# Altium project Bluetooth_tag_station_hv2.PrjPcb
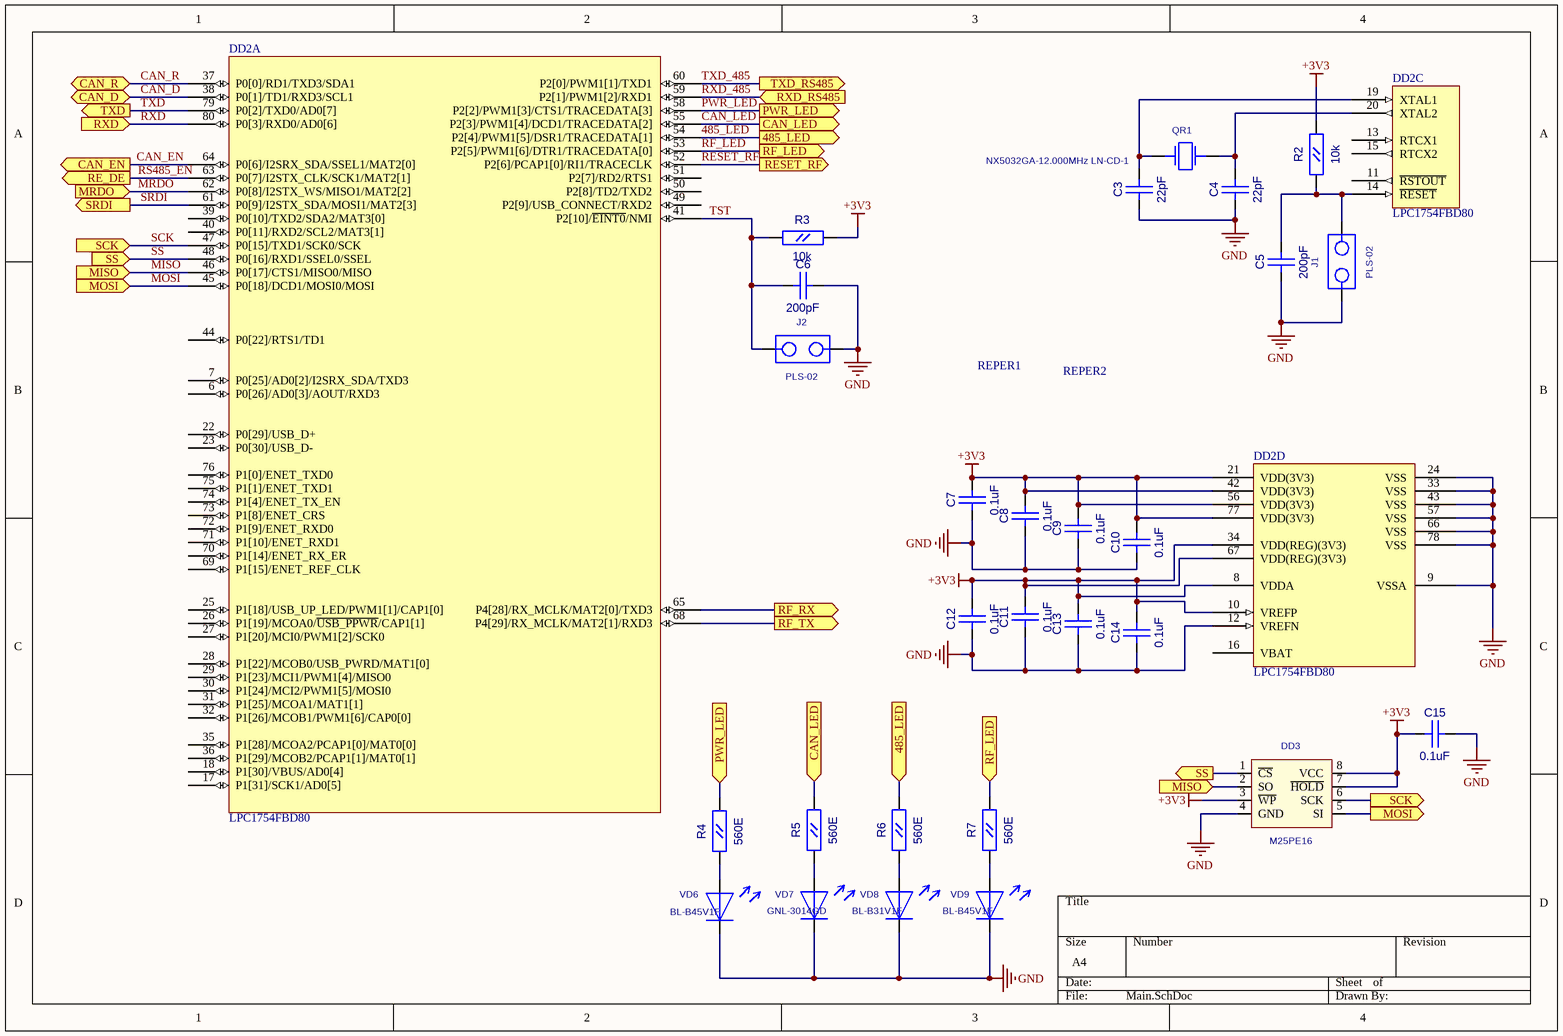
[diagram p0: Main.SchDoc]
3 sheets, 77 parts. Net scope: flat (ports and power ports of the same name join across sheets).
Board file: Bluetooth_tag_station_hv2.PcbDoc
Sheets:
  Main.SchDoc
  Interface.SchDoc
  Power.SchDoc

## Sheet Main.SchDoc
size A4

### Parts
(Parts that share a designator on the sheet are numbered #1, #2 ... from top to bottom, then left to right.)
C3  22pF  [CC0603]
C4  22pF  [CC0603]
C5  200pF  [CC0603]
C6  200pF  [CC0603]
C7  0.1uF  [CC0603]
C8  0.1uF  [CC0603]
C9  0.1uF  [CC0603]
C10  0.1uF  [CC0603]
C11  0.1uF  [CC0603]
C12  0.1uF  [CC0603]
C13  0.1uF  [CC0603]
C14  0.1uF  [CC0603]
C15  0.1uF  [CC0603]
DD2  LPC1754FBD80  [TQFP-80_0.5]  (parts A,C,D of 4)
DD3  M25PE16  [EIAJ_SO8]
J1  PLS-02  [PLS-02]
J2#1  PLS-02  [PLS-02]
QR1  NX5032GA-12.000MHz LN-CD-1  [AC5032_2]
R2  10k  [RC0603]
R3  10k  [RC0603]
R4  560E  [RC0603]
R5  560E  [RC0603]
R6  560E  [RC0603]
R7  560E  [RC0603]
REPER1  REPER1.2  [REPER1.2]  (value not drawn)
REPER2  REPER1.2  [REPER1.2]  (value not drawn)
VD6  BL-B45V1F  [LED3]
VD7  GNL-3014GD  [LED3]
VD8  BL-B31V1F  [LED3]
VD9  BL-B45V1F  [LED3]

### Ports
485_LED (in), 485_LED (out), CAN_D, CAN_EN (out), CAN_LED (in), CAN_LED (out), CAN_R, MISO (in), MOSI (in), MOSI (out), MRDO (in), PWR_LED (in), PWR_LED (out), RE_DE (out), RESET_RF (out), RF_LED (in), RF_LED (out), RF_RX (out), RF_TX (out), RXD (in), RXD_RS485 (in), SCK (in), SCK (out), SRDI (out), SS (in), SS (out), TXD (out), TXD_RS485 (out)

### Nets
+3V3: C7.2(B) C8.2(B) C9.2(B) C10.2(B) C11.2(B) C12.2(B) C13.2(B) C14.2(B) C15.1(A) DD2.8(VDDA) DD2.10(VREFP) DD2.21(VDD(3V3)) DD2.34(VDD(REG)(3V3)) DD2.42(VDD(3V3)) DD2.56(VDD(3V3)) DD2.67(VDD(REG)(3V3)) DD2.77(VDD(3V3)) DD3.3(~{WP}) DD3.7(~{HOLD}) DD3.8(VCC) R2.2(B) R3.2(B)
GND: C3.1(A) C4.1(A) C5.1(A) C6.2(B) C7.1(A) C8.1(A) C9.1(A) C10.1(A) C11.1(A) C12.1(A) C13.1(A) C14.1(A) C15.2(B) DD2.9(VSSA) DD2.12(VREFN) DD2.24(VSS) DD2.33(VSS) DD2.43(VSS) DD2.57(VSS) DD2.66(VSS) DD2.78(VSS) DD3.4(GND) J1.1 J2#1.2 VD6.1 VD7.1 VD8.1 VD9.1
485_LED: DD2.54(P2[4]/PWM1[5]/DSR1/TRACEDATA[1]) R6.2(B) ; port 485_LED
CAN_D: DD2.38(P0[1]/TD1/RXD3/SCL1) ; port CAN_D
CAN_EN: DD2.64(P0[6]/I2SRX_SDA/SSEL1/MAT2[0]) ; port CAN_EN
CAN_LED: DD2.55(P2[3]/PWM1[4]/DCD1/TRACEDATA[2]) R5.2(B) ; port CAN_LED
CAN_R: DD2.37(P0[0]/RD1/TXD3/SDA1) ; port CAN_R
MISO: DD2.46(P0[17]/CTS1/MISO0/MISO) DD3.2(SO) ; port MISO
MOSI: DD2.45(P0[18]/DCD1/MOSI0/MOSI) DD3.5(SI) ; port MOSI
MRDO: DD2.62(P0[8]/I2STX_WS/MISO1/MAT2[2]) ; port MRDO
PWR_LED: DD2.58(P2[2]/PWM1[3]/CTS1/TRACEDATA[3]) R4.2(B) ; port PWR_LED
RESET_RF: DD2.52(P2[6]/PCAP1[0]/RI1/TRACECLK) ; port RESET_RF
RF_LED: DD2.53(P2[5]/PWM1[6]/DTR1/TRACEDATA[0]) R7.2(B) ; port RF_LED
RF_RX: DD2.65(P4[28]/RX_MCLK/MAT2[0]/TXD3) ; port RF_RX
RF_TX: DD2.68(P4[29]/RX_MCLK/MAT2[1]/RXD3) ; port RF_TX
RS485_EN: DD2.63(P0[7]/I2STX_CLK/SCK1/MAT2[1]) ; port RE_DE
RXD: DD2.80(P0[3]/RXD0/AD0[6]) ; port RXD
RXD_485: DD2.59(P2[1]/PWM1[2]/RXD1) ; port RXD_RS485
SCK: DD2.47(P0[15]/TXD1/SCK0/SCK) DD3.6(SCK) ; port SCK
SRDI: DD2.61(P0[9]/I2STX_SDA/MOSI1/MAT2[3]) ; port SRDI
SS: DD2.48(P0[16]/RXD1/SSEL0/SSEL) DD3.1(~{CS}) ; port SS
TST: C6.1(A) DD2.41(P2[10]/~{EINT0}/NMI) J2#1.1 R3.1(A)
TXD: DD2.79(P0[2]/TXD0/AD0[7]) ; port TXD
TXD_485: DD2.60(P2[0]/PWM1[1]/TXD1) ; port TXD_RS485
NetC3_2: C3.2(B) DD2.19(XTAL1) QR1.1
NetC4_2: C4.2(B) DD2.20(XTAL2) QR1.2
NetC5_2: C5.2(B) DD2.14(~{RESET}) J1.2 R2.1(A)
NetR4_1: R4.1(A) VD6.2
NetR5_1: R5.1(A) VD7.2
NetR6_1: R6.1(A) VD8.2
NetR7_1: R7.1(A) VD9.2

Not connected (* = marked no-connect by the designer): DD2 6(P0[26]/AD0[3]/AOUT/RXD3) 7(P0[25]/AD0[2]/I2SRX_SDA/TXD3) 11(~{RSTOUT}) 13(RTCX1) 15(RTCX2) 16(VBAT) 17(P1[31]/SCK1/AD0[5]) 18(P1[30]/VBUS/AD0[4]) 22(P0[29]/USB_D+) 23(P0[30]/USB_D-) 25(P1[18]/USB_UP_LED/PWM1[1]/CAP1[0]) 26(P1[19]/MCOA0/~{USB_PPWR}/CAP1[1]) 27(P1[20]/MCI0/PWM1[2]/SCK0) 28(P1[22]/MCOB0/USB_PWRD/MAT1[0]) 29(P1[23]/MCI1/PWM1[4]/MISO0) 30(P1[24]/MCI2/PWM1[5]/MOSI0) 31(P1[25]/MCOA1/MAT1[1]) 32(P1[26]/MCOB1/PWM1[6]/CAP0[0]) 35(P1[28]/MCOA2/PCAP1[0]/MAT0[0]) 36(P1[29]/MCOB2/PCAP1[1]/MAT0[1]) 39(P0[10]/TXD2/SDA2/MAT3[0]) 40(P0[11]/RXD2/SCL2/MAT3[1]) 44(P0[22]/RTS1/TD1) 49(P2[9]/USB_CONNECT/RXD2) 50(P2[8]/TD2/TXD2) 51(P2[7]/RD2/RTS1) 69(P1[15]/ENET_REF_CLK) 70(P1[14]/ENET_RX_ER) 71(P1[10]/ENET_RXD1) 72(P1[9]/ENET_RXD0) 73(P1[8]/ENET_CRS) 74(P1[4]/ENET_TX_EN) 75(P1[1]/ENET_TXD1) 76(P1[0]/ENET_TXD0); REPER1 1; REPER2 1

### Library data of the parts
C3-C15 = CC0603
  C3 C4: Value: 22pF
  C5 C6: Value: 200pF
  C7-C15: Value: 0.1uF
DD2 = LPC1754FBD80: Cortex -M3 32-Bit Microcontroller, 128KB Flash, 64KB RAM, 800-Lead LQFP; ComponentLink1Description: Manufacturer Link; ComponentLink1URL: http://www.nxp.com/
DD3 = S25FL016A0LMFI01: Value: M25PE16
QR1 = AC5032_2: AC5032/2; Value: NX5032GA-12.000MHz LN-CD-1
R2-R7 = RC0603
  R2 R3: Value: 10k
  R4-R7: Value: 560E
VD6-VD9 = LED_3
  VD6 VD9: Value: BL-B45V1F
  VD7: Value: GNL-3014GD
  VD8: Value: BL-B31V1F
J1 J2#1 = PLS-02: Value: *
REPER1 REPER2 = REPER1.2: Value: *

## Sheet Interface.SchDoc
size A4
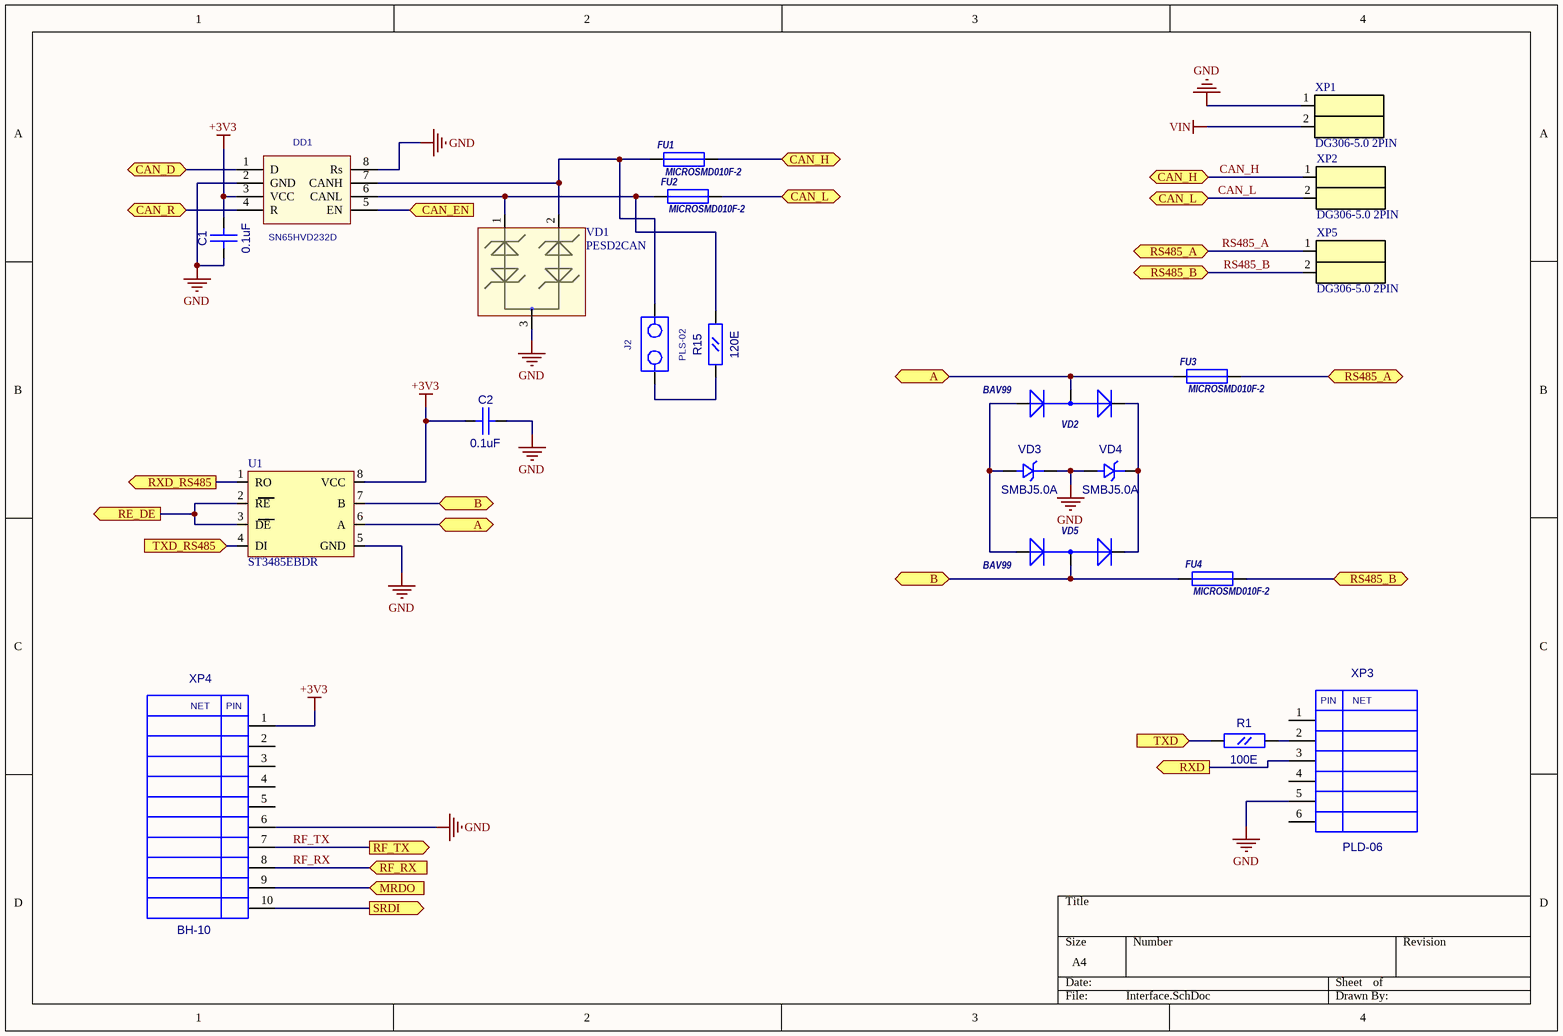
[diagram p1: Interface.SchDoc]

### Parts
(Parts that share a designator on the sheet are numbered #1, #2 ... from top to bottom, then left to right.)
C1  0.1uF  [CC0603]
C2  0.1uF  [CC0603]
DD1  SN65HVD232D  [SO-8]
FU1  MICROSMD010F-2  [RC1210]
FU2  MICROSMD010F-2  [RC1210]
FU3  MICROSMD010F-2  [RC1210]
FU4  MICROSMD010F-2  [RC1210]
J2#2  PLS-02  [PLS-02]
R1  100E  [RC0603]
R15  120E  [RC0805]
U1  ST3485EBDR  [SO-8]
VD1  PESD2CAN  [SOT-23(123)]
VD2  BAV99  [SOT-23(GSD)]
VD3  SMBJ5.0A  [SMB]
VD4  SMBJ5.0A  [SMB]
VD5  BAV99  [SOT-23(GSD)]
XP1  DG306-5.0 2PIN  [DG306-5.0]
XP2  DG306-5.0 2PIN  [DG306-5.0]
XP3  PLD-06  [PIN6]
XP4  BH-10  [BH-10]
XP5  DG306-5.0 2PIN  [DG306-5.0]

### Ports
A (bidir), B (bidir), CAN_D, CAN_EN (in), CAN_H, CAN_L, CAN_R, MRDO (in), RE_DE (out), RF_RX (in), RF_TX (out), RS485_A, RS485_B, RXD (out), RXD_RS485 (out), SRDI (out), TXD (in), TXD_RS485 (in)

### Nets
+3V3: C1.2(B) C2.1(A) DD1.3(VCC) U1.8(VCC) XP4.1
GND: C1.1(A) C2.2(B) DD1.2(GND) DD1.8(Rs) U1.5(GND) VD1.3 VD3.2(K) VD4.1(A) XP1.1 XP3.5 XP4.6
VIN: XP1.2
CAN_D: DD1.1(D) ; port CAN_D
CAN_EN: DD1.5(EN) ; port CAN_EN
CAN_H: FU1.2 XP2.1 ; port CAN_H
CAN_L: FU2.2 XP2.2 ; port CAN_L
CAN_R: DD1.4(R) ; port CAN_R
MRDO: XP4.9 ; port MRDO
RF_RX: XP4.8 ; port RF_RX
RF_TX: XP4.7 ; port RF_TX
RS485_A: FU3.2 XP5.1 ; port RS485_A
RS485_B: FU4.2 XP5.2 ; port RS485_B
RS485_EN: U1.2(RE) U1.3(DE) ; port RE_DE
RXD: XP3.3 ; port RXD
RXD_485: U1.1(RO) ; port RXD_RS485
SRDI: XP4.10 ; port SRDI
TXD: R1.1(A) ; port TXD
TXD_485: U1.4(DI) ; port TXD_RS485
NetDD1_6: DD1.6(CANL) FU2.1 R15.2(B) VD1.1
NetDD1_7: DD1.7(CANH) FU1.1 J2#2.2 VD1.2
NetFU3_1: FU3.1 U1.6(A) VD2.3(AK) ; port A
NetFU4_1: FU4.1 U1.7(B) VD5.3(AK) ; port B
NetJ2#2_1: J2#2.1 R15.1(A)
NetR1_2: R1.2(B) XP3.2
NetVD2_1: VD2.1(A) VD3.1(A) VD5.1(A)
NetVD2_2: VD2.2(K) VD4.2(K) VD5.2(K)

Not connected (* = marked no-connect by the designer): XP3 1 4 6; XP4 2 3 4 5

### Notes on the sheet
- (in symbol BH-10) NET; PIN
- (in symbol PLD-06) PIN; NET

### Library data of the parts
C1 C2 = CC0603: Value: 0.1uF
DD1 = SN65HVD234D: CAN Transceiver; Value: *
FU1-FU4 = MICROSMD: Value: MICROSMD010F-2
R1 = RC0603: Value: 100E
R15 = RC0805: Value: 120E
VD1 = PESD2CAN: TVS for CAN
VD2 VD5 = BAV99: 1.0 Ampere General Purpose Rectifier; ComponentField6: Published 8-Jun-2000, Modified 11-July-2000: SIM Model Added.; Value: *
VD3 VD4 = SMBJ: Value: SMBJ5.0A
XP3 = PLD-06: PLD06; Value: *
J2#2 = PLS-02: Value: *
U1 = ST3485EBDR: Value: ST3485EBDR
XP1 XP2 XP5 = DG306-5.0 2PIN: Value: DG306-5.0 2PIN
XP4 = BH-10: Value: *

## Sheet Power.SchDoc
size A4
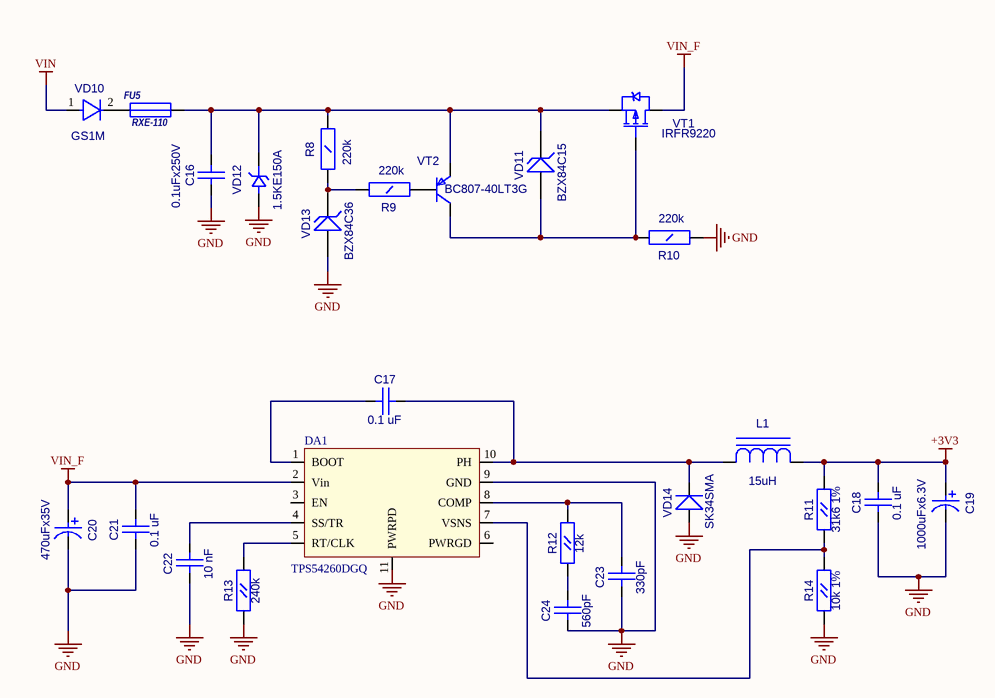
[diagram p2: Power.SchDoc]

### Parts
C16  0.1uFx250V  [CC1206]
C17  0.1 uF  [CC0603]
C18  0.1 uF  [CC0603]
C19  1000uFx6.3V  [CC8X3.5]
C20  470uFx35V  [CC16X10_CAP0.5(1)(Primary)]
C21  0.1 uF  [CC0603]
C22  10 nF  [CC0603]
C23  330pF  [CC0603]
C24  560pF  [CC0603]
DA1  TPS54260DGQ  [S-PDSO-G10]
FU5  RXE-110  [RXE-110]
L1  15uH  [SDR0805]
R8  220k  [RC1206]
R9  220k  [RC1206]
R10  220k  [RC1206]
R11  31k6 1%  [RC0603]
R12  12k  [RC0603]
R13  240k  [RC0603]
R14  10k 1%  [RC0603]
VD10  GS1M  [SMA]
VD11  BZX84C15  [SOT-23(123)]
VD12  1.5KE150A  [DO-201]
VD13  BZX84C36  [SOT-23(123)]
VD14  SK34SMA  [SMA]
VT1  IRFR9220  [D-PAK(TO-252AA)]
VT2  BC807-40LT3G  [SOT-23(123)]

### Nets
+3V3: C18.1(A) C19.1 L1.2(A) R11.2(B)
GND: C16.1(A) C18.2(B) C19.2 C20.1 C21.2(B) C22.2(B) C23.2(B) C24.2(B) DA1.9(GND) DA1.11(PWRPD) R10.1(A) R13.1(A) R14.1(A) VD12.1(A) VD13.1(A) VD14.1(A)
VIN: VD10.1(A)
VIN_F: C20.2 C21.1(A) DA1.2(Vin) VT1.3(D)
NetC16_2: C16.2(B) FU5.2 R8.2(B) VD11.3(K) VD12.2(K) VT1.2(S) VT2.2(E)
NetC17_1: C17.1(A) DA1.10(PH) L1.1(C) VD14.2(K)
NetC17_2: C17.2(B) DA1.1(BOOT)
NetC22_1: C22.1(A) DA1.4(SS/TR)
NetC23_1: C23.1(A) DA1.8(COMP) R12.2(B)
NetC24_1: C24.1(A) R12.1(A)
NetDA1_5: DA1.5(RT/CLK) R13.2(B)
NetDA1_7: DA1.7(VSNS) R11.1(A) R14.2(B)
NetFU5_1: FU5.1 VD10.2(K)
NetR8_1: R8.1(A) R9.2(B) VD13.3(K)
NetR9_1: R9.1(A) VT2.1(B)
NetR10_2: R10.2(B) VD11.1(A) VT1.1(G) VT2.3(C)

Not connected (* = marked no-connect by the designer): DA1 3(EN) 6(PWRGD)

### Library data of the parts
C16 = CC1206: Value: 0.1uFx250V
C17 C18 C21-C24 = CC0603
  C17 C18 C21: Value: 0.1 uF
  C22: Value: 10 nF
  C23: Value: 330pF
  C24: Value: 560pF
C19 = CAP0.35: Value: 1000uFx6.3V
C20 = CAP0.5(1): Value: 470uFx35V
L1 = SDR0805: Value: 15uH
R8-R10 = RC1206: Value: 220k
R11-R14 = RC0603
  R11: Value: 31k6 1%
  R12: Value: 12k
  R13: Value: 240k
  R14: Value: 10k 1%
VD10 = GS1M: Value: {Value}
VD11 VD13 = BZX84: Zener Voltage Regulator Diode
  VD11: Value: BZX84C15
  VD13: Value: BZX84C36
VD12 = 1.5KE: Value: 1.5KE150A
VD14 = SK34SMA: Schottky Rectifier; Value: {Value}
VT1 = IRFR9220: HEXFET Power MOSFET; OriginalName: IRLML5103; ComponentField7: Published 8-Jun-2000; Value: IRFR9220
VT2 = BC856B: OriginalName: BC856BLT; ComponentField7: Published 29-Sep-2000; Value: BC807-40LT3G
FU5 = RXE-110: Value: *

## Nets that join several sheets
+3V3: Main (22 pins), Interface (5 pins), Power (C18.1 C19.1 L1.2 R11.2)
GND: Main (28 pins), Interface (11 pins), Power (16 pins)
VIN: Interface (XP1.2), Power (VD10.1)
CAN_D: Main (DD2.38), Interface (DD1.1)
CAN_EN: Main (DD2.64), Interface (DD1.5)
CAN_R: Main (DD2.37), Interface (DD1.4)
MRDO: Main (DD2.62), Interface (XP4.9)
RF_RX: Main (DD2.65), Interface (XP4.8)
RF_TX: Main (DD2.68), Interface (XP4.7)
RS485_EN: Main (DD2.63), Interface (U1.2 U1.3)
RXD: Main (DD2.80), Interface (XP3.3)
RXD_485: Main (DD2.59), Interface (U1.1)
SRDI: Main (DD2.61), Interface (XP4.10)
TXD: Main (DD2.79), Interface (R1.1)
TXD_485: Main (DD2.60), Interface (U1.4)